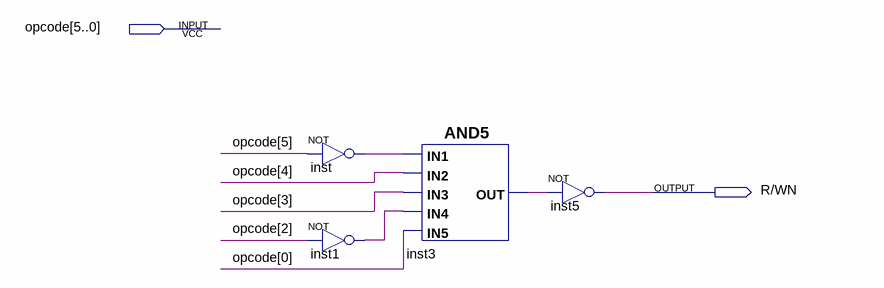
[diagram p0: schematic sheet]
// Quartus schematic R_WN_decode.bdf as structural Verilog: 4 symbols, 2 pins
module R_WN_decode (
  input  [5:0] opcode,
  output \R/WN 
);

  wire inst1_out, inst3_out, inst_out;

  not inst (inst_out, opcode[5]);
  not inst1 (inst1_out, opcode[2]);
  and inst3 (inst3_out, inst_out, opcode[4], opcode[3], inst1_out, opcode[0]);
  not inst5 (\R/WN , inst3_out);
endmodule
